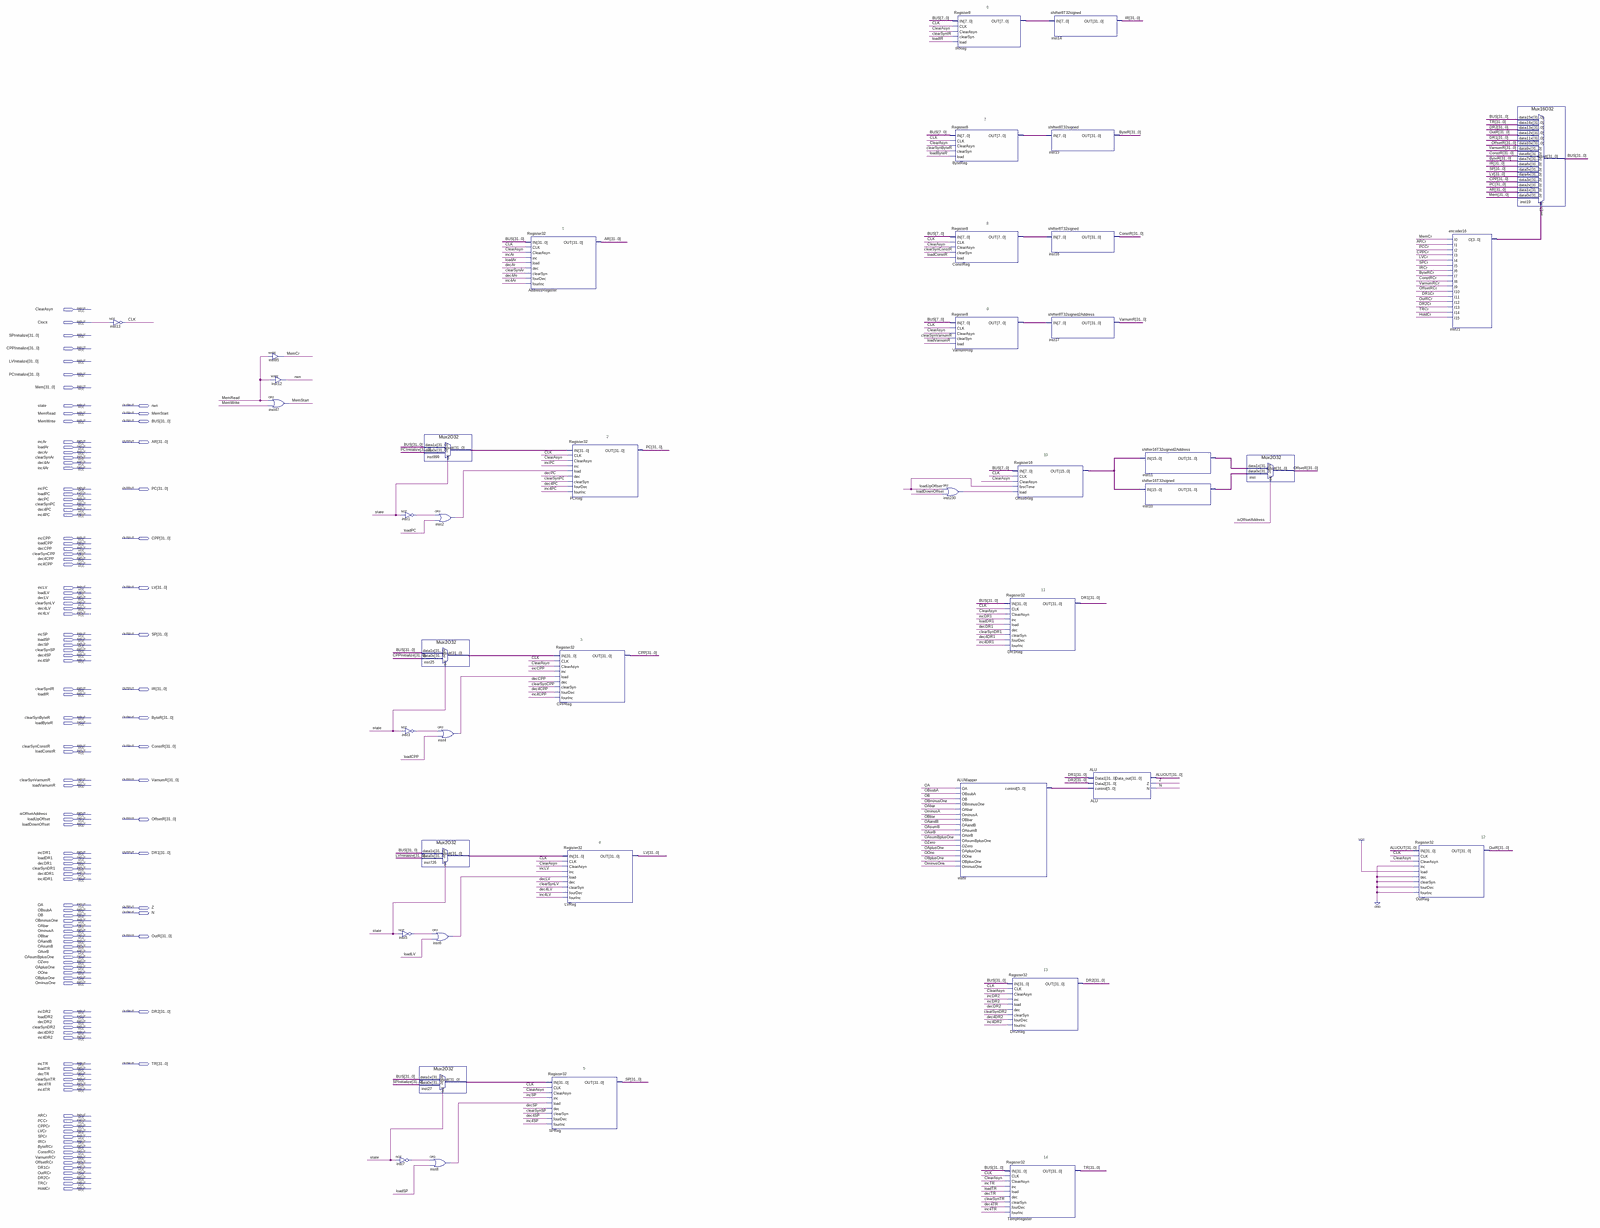
[diagram p0: schematic sheet, whole]
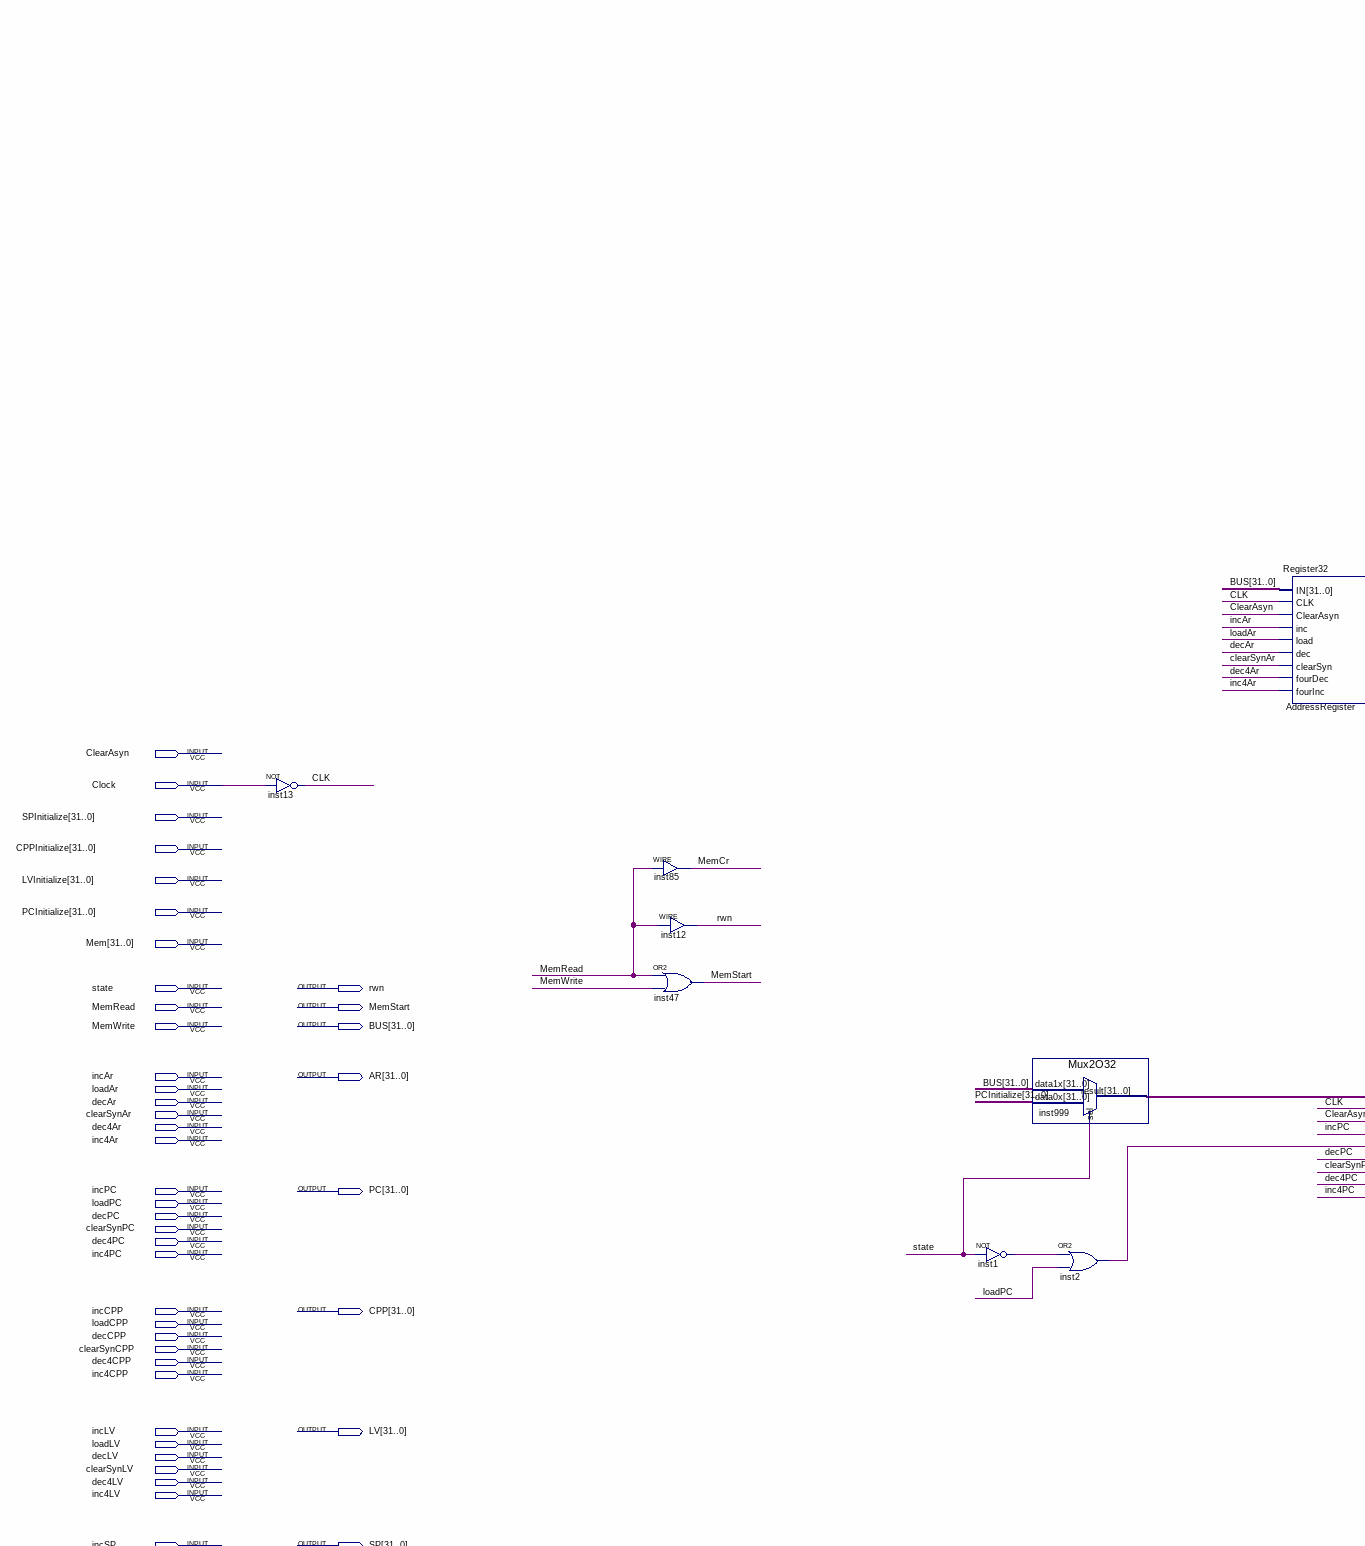
[diagram p1: schematic sheet, upper left part]
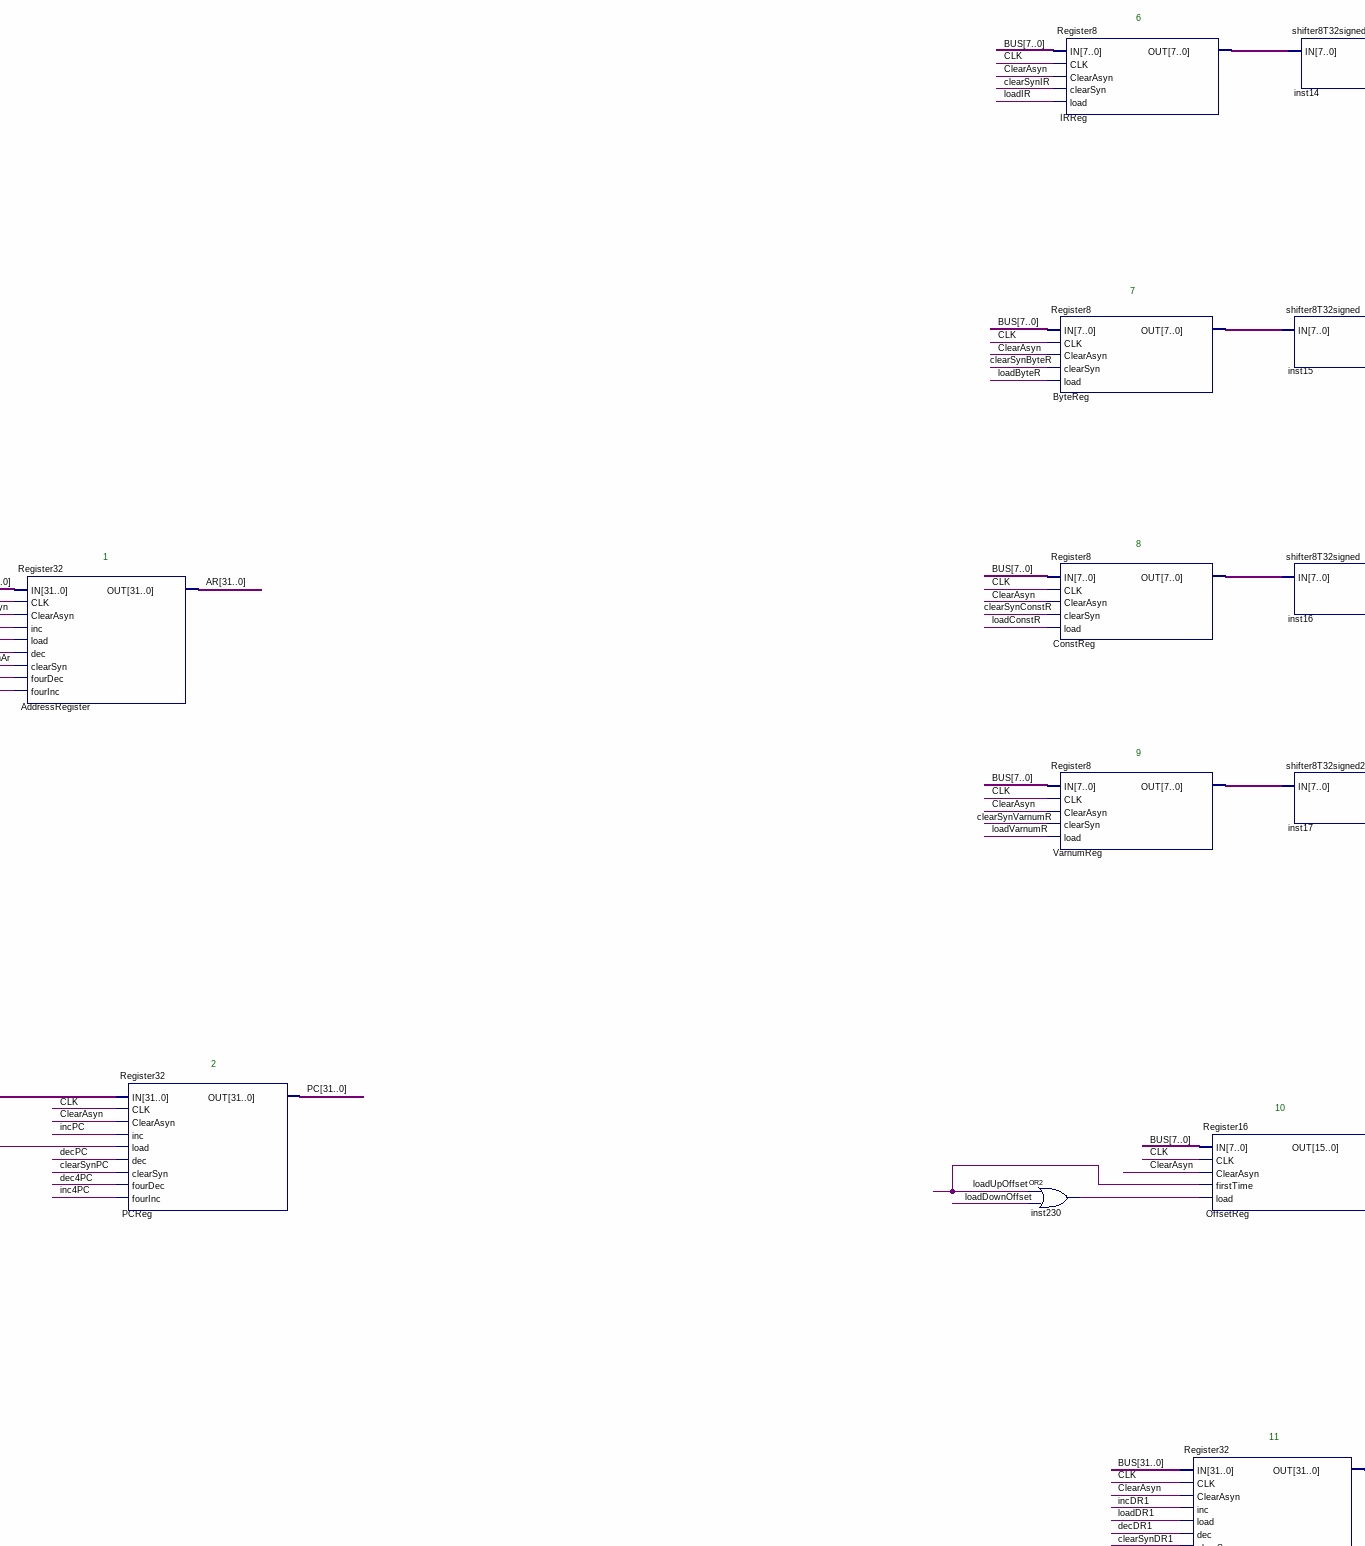
[diagram p2: schematic sheet, upper centre part]
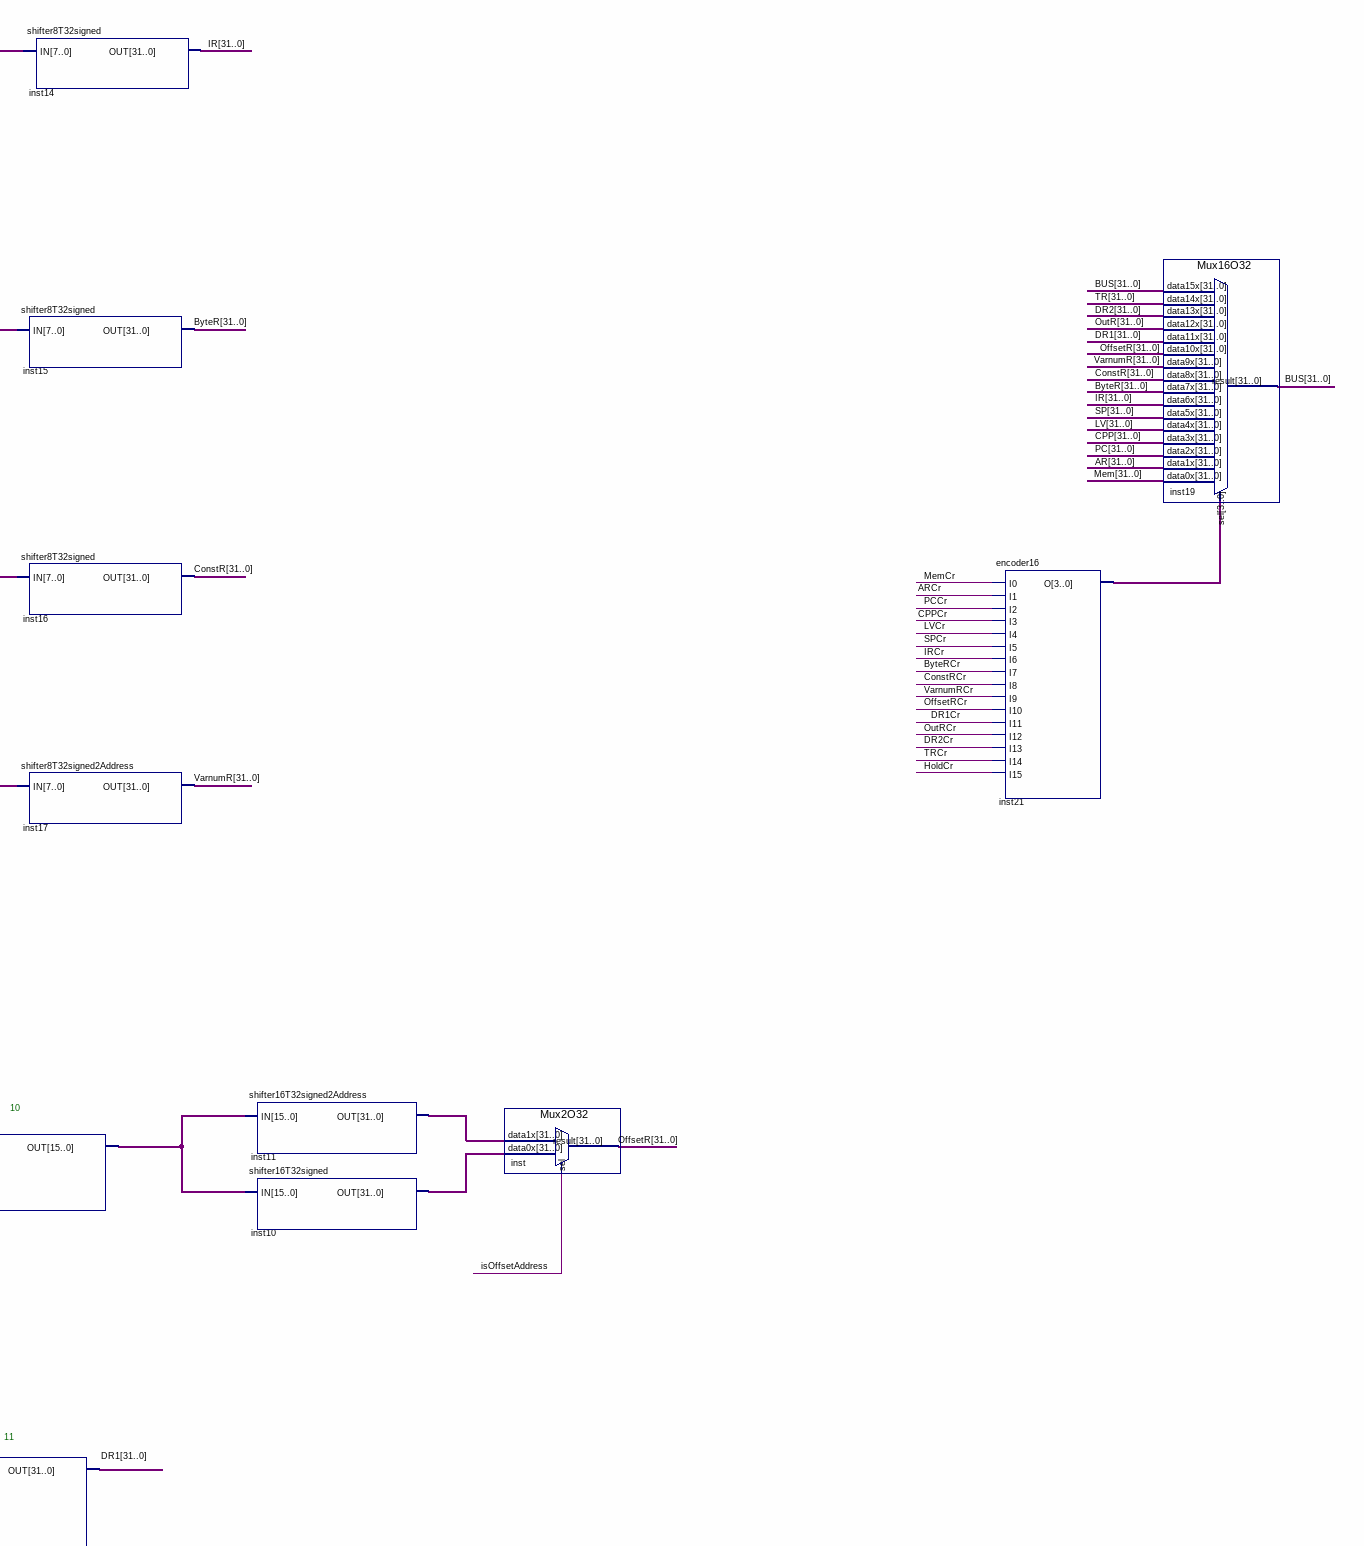
[diagram p3: schematic sheet, upper right part]
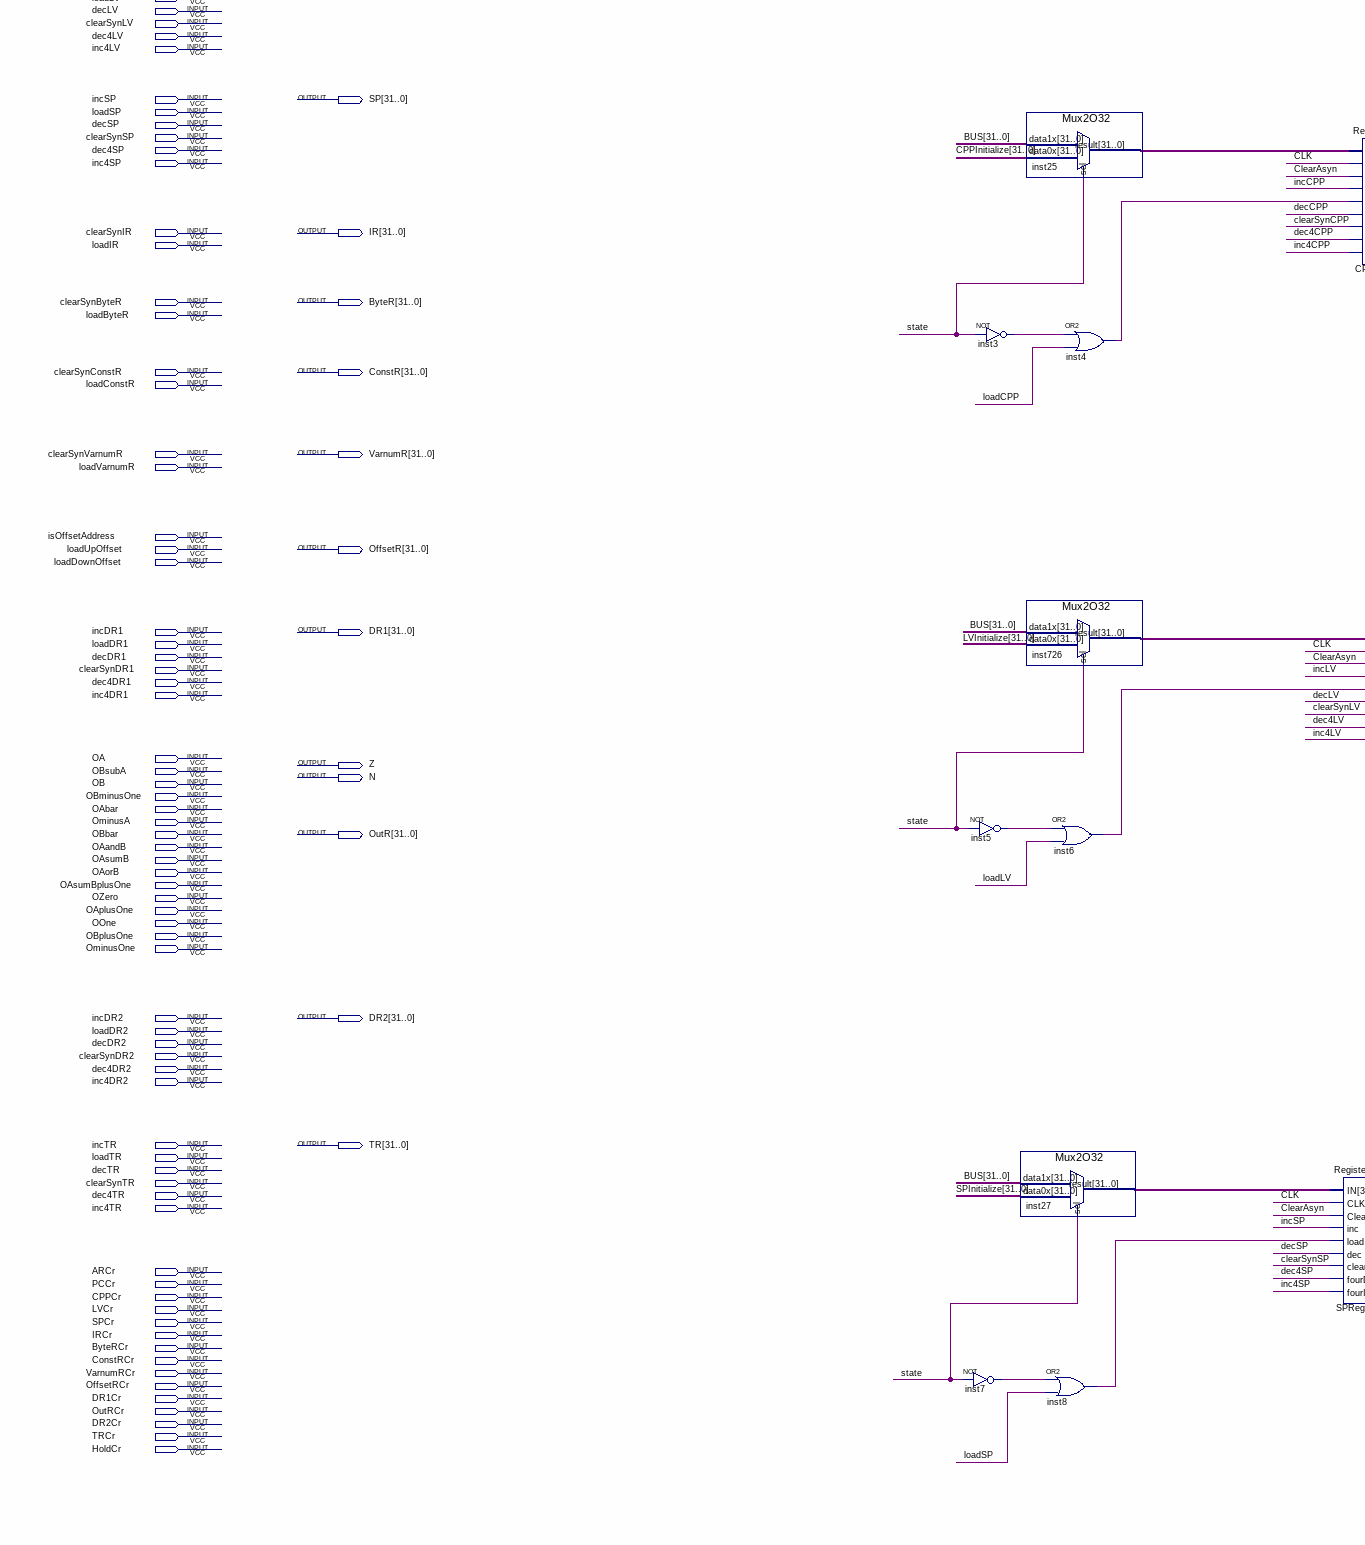
[diagram p4: schematic sheet, lower left part]
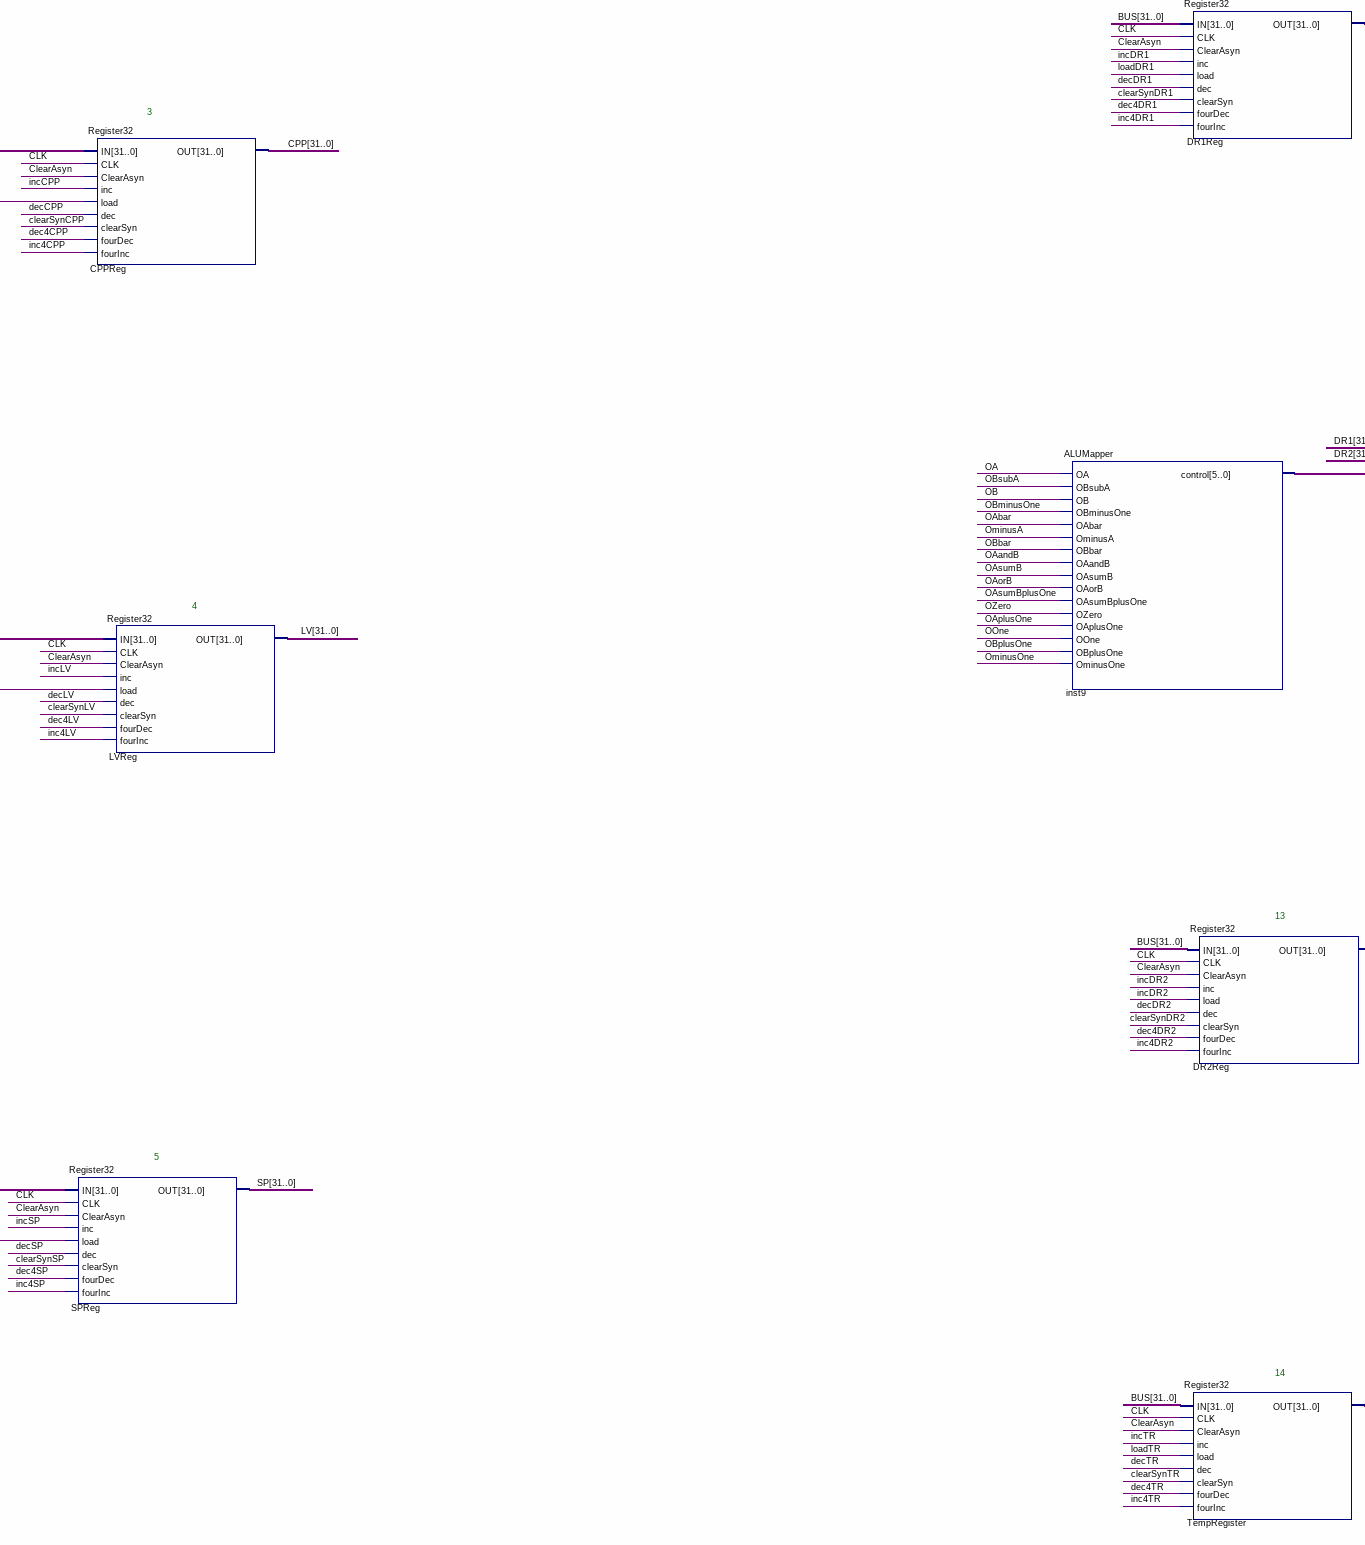
[diagram p5: schematic sheet, lower centre part]
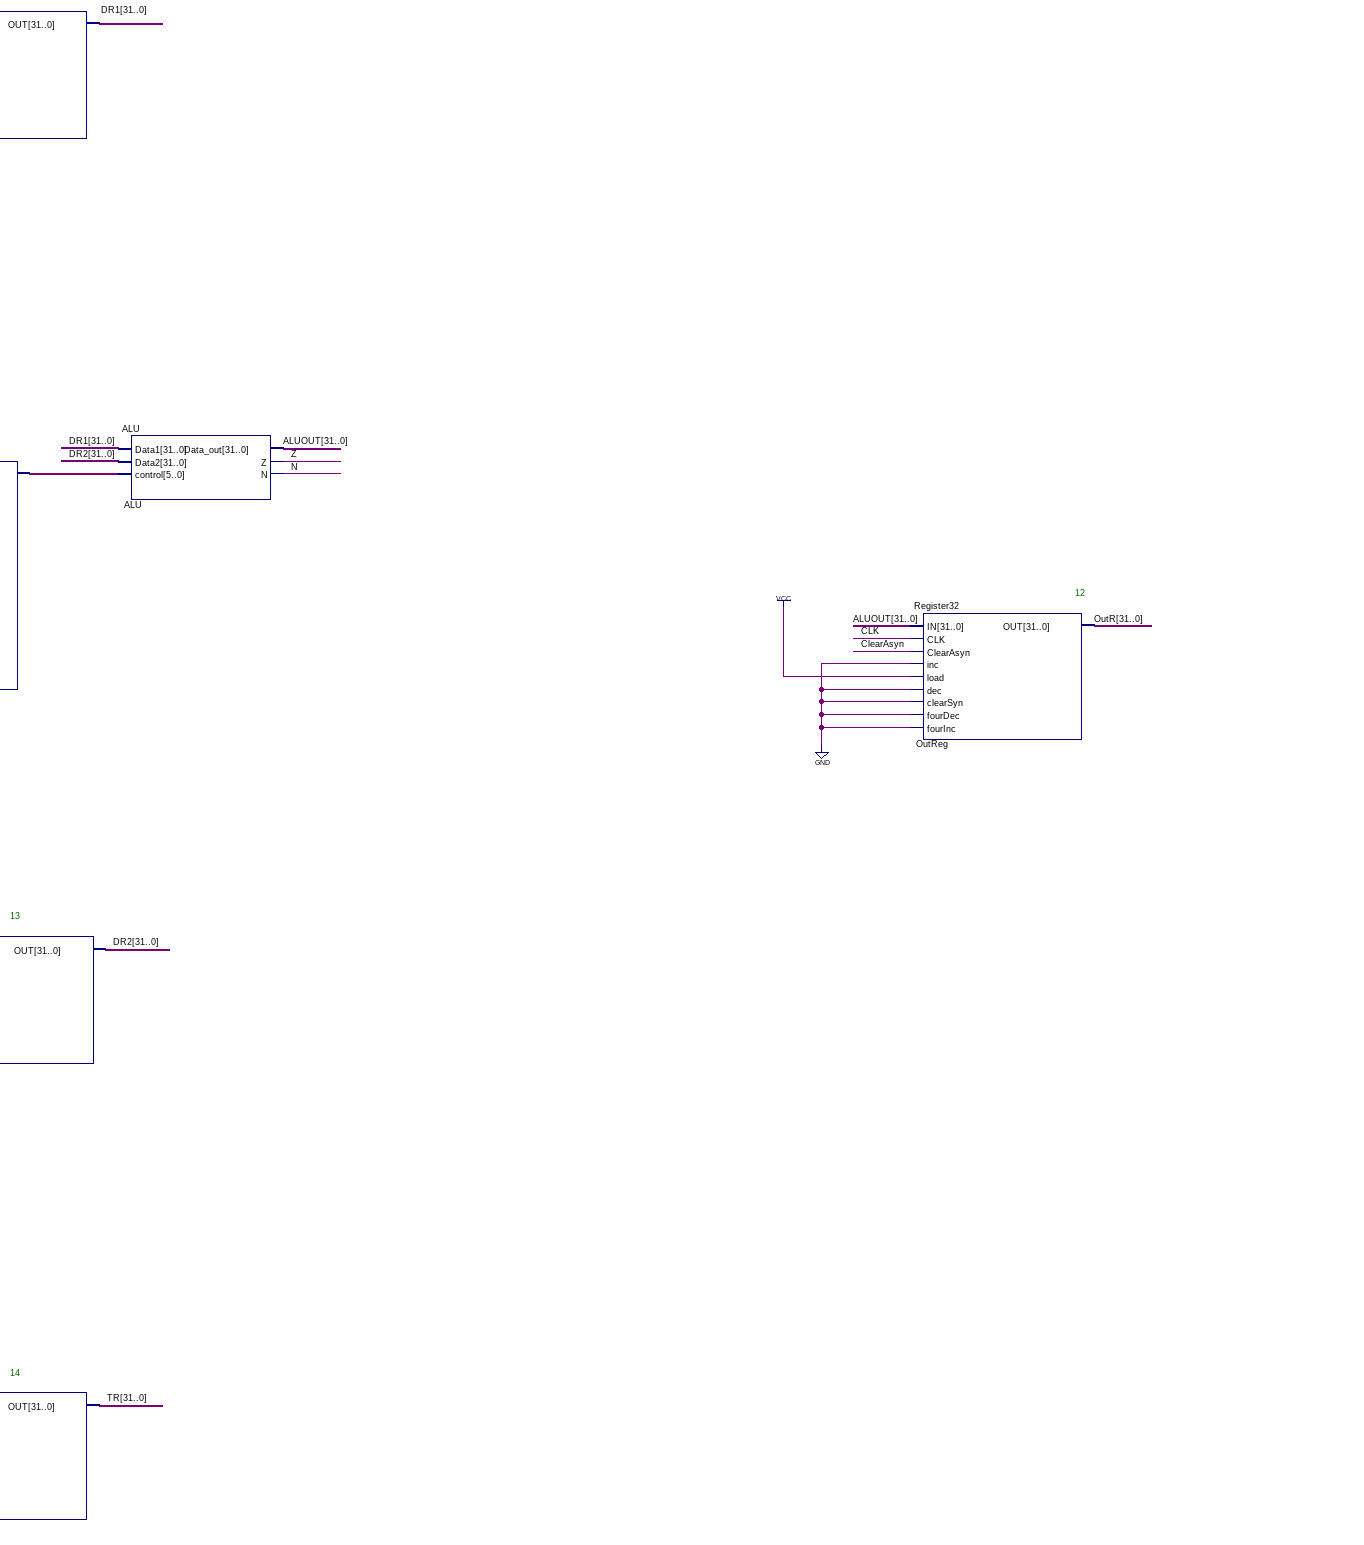
[diagram p6: schematic sheet, lower right part]
// Quartus schematic DataPath2.bdf as structural Verilog: 42 symbols, 119 pins
module DataPath2 (
  input  ClearAsyn,
  input  Clock,
  input  [31:0] SPInitialize,
  input  [31:0] CPPInitialize,
  input  [31:0] LVInitialize,
  input  [31:0] PCInitialize,
  input  [31:0] Mem,
  input  state,
  input  MemRead,
  input  MemWrite,
  input  incAr,
  input  loadAr,
  input  decAr,
  input  clearSynAr,
  input  dec4Ar,
  input  inc4Ar,
  input  incPC,
  input  loadPC,
  input  decPC,
  input  clearSynPC,
  input  dec4PC,
  input  inc4PC,
  input  incCPP,
  input  loadCPP,
  input  decCPP,
  input  clearSynCPP,
  input  dec4CPP,
  input  inc4CPP,
  input  incLV,
  input  loadLV,
  input  decLV,
  input  clearSynLV,
  input  dec4LV,
  input  inc4LV,
  input  incSP,
  input  loadSP,
  input  decSP,
  input  clearSynSP,
  input  dec4SP,
  input  inc4SP,
  input  clearSynIR,
  input  loadIR,
  input  clearSynByteR,
  input  loadByteR,
  input  clearSynConstR,
  input  loadConstR,
  input  clearSynVarnumR,
  input  loadVarnumR,
  input  isOffsetAddress,
  input  loadUpOffset,
  input  loadDownOffset,
  input  incDR1,
  input  loadDR1,
  input  decDR1,
  input  clearSynDR1,
  input  dec4DR1,
  input  inc4DR1,
  input  OA,
  input  OBsubA,
  input  OB,
  input  OBminusOne,
  input  OAbar,
  input  OminusA,
  input  OBbar,
  input  OAandB,
  input  OAsumB,
  input  OAorB,
  input  OAsumBplusOne,
  input  OZero,
  input  OAplusOne,
  input  OOne,
  input  OBplusOne,
  input  OminusOne,
  input  incDR2,
  input  loadDR2,
  input  decDR2,
  input  clearSynDR2,
  input  dec4DR2,
  input  inc4DR2,
  input  incTR,
  input  loadTR,
  input  decTR,
  input  clearSynTR,
  input  dec4TR,
  input  inc4TR,
  input  ARCr,
  input  PCCr,
  input  CPPCr,
  input  LVCr,
  input  SPCr,
  input  IRCr,
  input  ByteRCr,
  input  ConstRCr,
  input  VarnumRCr,
  input  OffsetRCr,
  input  DR1Cr,
  input  OutRCr,
  input  DR2Cr,
  input  TRCr,
  input  HoldCr,
  output rwn,
  output MemStart,
  output [31:0] BUS,
  output [31:0] AR,
  output [31:0] PC,
  output [31:0] CPP,
  output [31:0] LV,
  output [31:0] SP,
  output [31:0] IR,
  output [31:0] ByteR,
  output [31:0] ConstR,
  output [31:0] VarnumR,
  output [31:0] OffsetR,
  output [31:0] DR1,
  output Z,
  output N,
  output [31:0] OutR,
  output [31:0] DR2,
  output [31:0] TR
);

  wire CLK, inst1_out, inst2_out, inst3_out, inst4_out, inst5_out, inst6_out, inst7_out, inst8_out,
       inst230_out, MemCr;
  wire [3:0] inst21_o;
  wire [5:0] inst9_control;
  wire [7:0] ByteReg_out, ConstReg_out, IRReg_out, VarnumReg_out;
  wire [15:0] OffsetReg_out;
  wire [31:0] ALUOUT, inst10_out, inst11_out, inst25_result, inst27_result, inst726_result, inst999_result;

  not inst13 (CLK, Clock);
  assign MemCr = MemRead;  // WIRE inst85
  assign rwn = MemRead;  // WIRE inst12
  or inst47 (MemStart, MemRead, MemWrite);
  not inst1 (inst1_out, state);
  not inst3 (inst3_out, state);
  not inst5 (inst5_out, state);
  not inst7 (inst7_out, state);
  Mux2O32 inst999 (.data1x(BUS), .data0x(PCInitialize), .sel(state), .result(inst999_result));
  Mux2O32 inst25 (.data1x(BUS), .data0x(CPPInitialize), .sel(state), .result(inst25_result));
  Mux2O32 inst726 (.data1x(BUS), .data0x(LVInitialize), .sel(state), .result(inst726_result));
  Mux2O32 inst27 (.data1x(BUS), .data0x(SPInitialize), .sel(state), .result(inst27_result));
  or inst2 (inst2_out, inst1_out, loadPC);
  or inst4 (inst4_out, inst3_out, loadCPP);
  or inst6 (inst6_out, inst5_out, loadLV);
  or inst8 (inst8_out, inst7_out, loadSP);
  Register32 AddressRegister (
    .IN(BUS), .CLK(CLK), .ClearAsyn(ClearAsyn), .inc(incAr), .load(loadAr), .dec(decAr),
    .clearSyn(clearSynAr), .fourDec(dec4Ar), .fourInc(inc4Ar), .OUT(AR));
  Register32 SPReg (
    .IN(inst27_result), .CLK(CLK), .ClearAsyn(ClearAsyn), .inc(incSP), .load(inst8_out), .dec(decSP),
    .clearSyn(clearSynSP), .fourDec(dec4SP), .fourInc(inc4SP), .OUT(SP));
  Register32 PCReg (
    .IN(inst999_result), .CLK(CLK), .ClearAsyn(ClearAsyn), .inc(incPC), .load(inst2_out), .dec(decPC),
    .clearSyn(clearSynPC), .fourDec(dec4PC), .fourInc(inc4PC), .OUT(PC));
  Register32 CPPReg (
    .IN(inst25_result), .CLK(CLK), .ClearAsyn(ClearAsyn), .inc(incCPP), .load(inst4_out), .dec(decCPP),
    .clearSyn(clearSynCPP), .fourDec(dec4CPP), .fourInc(inc4CPP), .OUT(CPP));
  Register32 LVReg (
    .IN(inst726_result), .CLK(CLK), .ClearAsyn(ClearAsyn), .inc(incLV), .load(inst6_out), .dec(decLV),
    .clearSyn(clearSynLV), .fourDec(dec4LV), .fourInc(inc4LV), .OUT(LV));
  or inst230 (inst230_out, loadUpOffset, loadDownOffset);
  Register8 IRReg (
    .IN(BUS[7:0]), .CLK(CLK), .ClearAsyn(ClearAsyn), .clearSyn(clearSynIR), .load(loadIR), .OUT(IRReg_out));
  Register8 ByteReg (
    .IN(BUS[7:0]), .CLK(CLK), .ClearAsyn(ClearAsyn), .clearSyn(clearSynByteR), .load(loadByteR),
    .OUT(ByteReg_out));
  Register8 ConstReg (
    .IN(BUS[7:0]), .CLK(CLK), .ClearAsyn(ClearAsyn), .clearSyn(clearSynConstR), .load(loadConstR),
    .OUT(ConstReg_out));
  Register8 VarnumReg (
    .IN(BUS[7:0]), .CLK(CLK), .ClearAsyn(ClearAsyn), .clearSyn(clearSynVarnumR), .load(loadVarnumR),
    .OUT(VarnumReg_out));
  ALUMapper inst9 (
    .OA(OA), .OBsubA(OBsubA), .OB(OB), .OBminusOne(OBminusOne), .OAbar(OAbar), .OminusA(OminusA),
    .OBbar(OBbar), .OAandB(OAandB), .OAsumB(OAsumB), .OAorB(OAorB), .OAsumBplusOne(OAsumBplusOne),
    .OZero(OZero), .OAplusOne(OAplusOne), .OOne(OOne), .OBplusOne(OBplusOne), .OminusOne(OminusOne),
    .control(inst9_control));
  Register32 DR1Reg (
    .IN(BUS), .CLK(CLK), .ClearAsyn(ClearAsyn), .inc(incDR1), .load(loadDR1), .dec(decDR1),
    .clearSyn(clearSynDR1), .fourDec(dec4DR1), .fourInc(inc4DR1), .OUT(DR1));
  Register32 DR2Reg (
    .IN(BUS), .CLK(CLK), .ClearAsyn(ClearAsyn), .inc(incDR2), .load(incDR2), .dec(decDR2),
    .clearSyn(clearSynDR2), .fourDec(dec4DR2), .fourInc(inc4DR2), .OUT(DR2));
  Register32 TempRegister (
    .IN(BUS), .CLK(CLK), .ClearAsyn(ClearAsyn), .inc(incTR), .load(loadTR), .dec(decTR),
    .clearSyn(clearSynTR), .fourDec(dec4TR), .fourInc(inc4TR), .OUT(TR));
  Register16 OffsetReg (
    .IN(BUS[7:0]), .CLK(CLK), .ClearAsyn(ClearAsyn), .firstTime(loadUpOffset), .load(inst230_out),
    .OUT(OffsetReg_out));
  shifter8T32signed inst14 (.IN(IRReg_out), .OUT(IR));
  shifter8T32signed inst15 (.IN(ByteReg_out), .OUT(ByteR));
  shifter8T32signed inst16 (.IN(ConstReg_out), .OUT(ConstR));
  shifter8T32signed2Address inst17 (.IN(VarnumReg_out), .OUT(VarnumR));
  ALU ALU (.Data1(DR1), .Data2(DR2), .control(inst9_control), .Data_out(ALUOUT), .Z(Z), .N(N));
  shifter16T32signed2Address inst11 (.IN(OffsetReg_out), .OUT(inst11_out));
  shifter16T32signed inst10 (.IN(OffsetReg_out), .OUT(inst10_out));
  Mux2O32 inst (.data1x(inst11_out), .data0x(inst10_out), .sel(isOffsetAddress), .result(OffsetR));
  Register32 OutReg (
    .IN(ALUOUT), .CLK(CLK), .ClearAsyn(ClearAsyn), .inc(1'b0), .load(1'b1), .dec(1'b0), .clearSyn(1'b0),
    .fourDec(1'b0), .fourInc(1'b0), .OUT(OutR));
  encoder16 inst21 (
    .I0(MemCr), .I1(ARCr), .I2(PCCr), .I3(CPPCr), .I4(LVCr), .I5(SPCr), .I6(IRCr), .I7(ByteRCr),
    .I8(ConstRCr), .I9(VarnumRCr), .I10(OffsetRCr), .I11(DR1Cr), .I12(OutRCr), .I13(DR2Cr), .I14(TRCr),
    .I15(HoldCr), .O(inst21_o));
  Mux16O32 inst19 (
    .data15x(BUS), .data14x(TR), .data13x(DR2), .data12x(OutR), .data11x(DR1), .data10x(OffsetR),
    .data9x(VarnumR), .data8x(ConstR), .data7x(ByteR), .data6x(IR), .data5x(SP), .data4x(LV), .data3x(CPP),
    .data2x(PC), .data1x(AR), .data0x(Mem), .sel(inst21_o), .result(BUS));

  // Notes on the sheet:
  //   6
  //   7
  //   8
  //   1
  //   9
  //   2
  //   10
  //   11
  //   3
  //   12
  //   4
  //   13
  //   5
  //   14
endmodule
